# EAGLE design JFETPreamp (EAGLE 6.5.0)
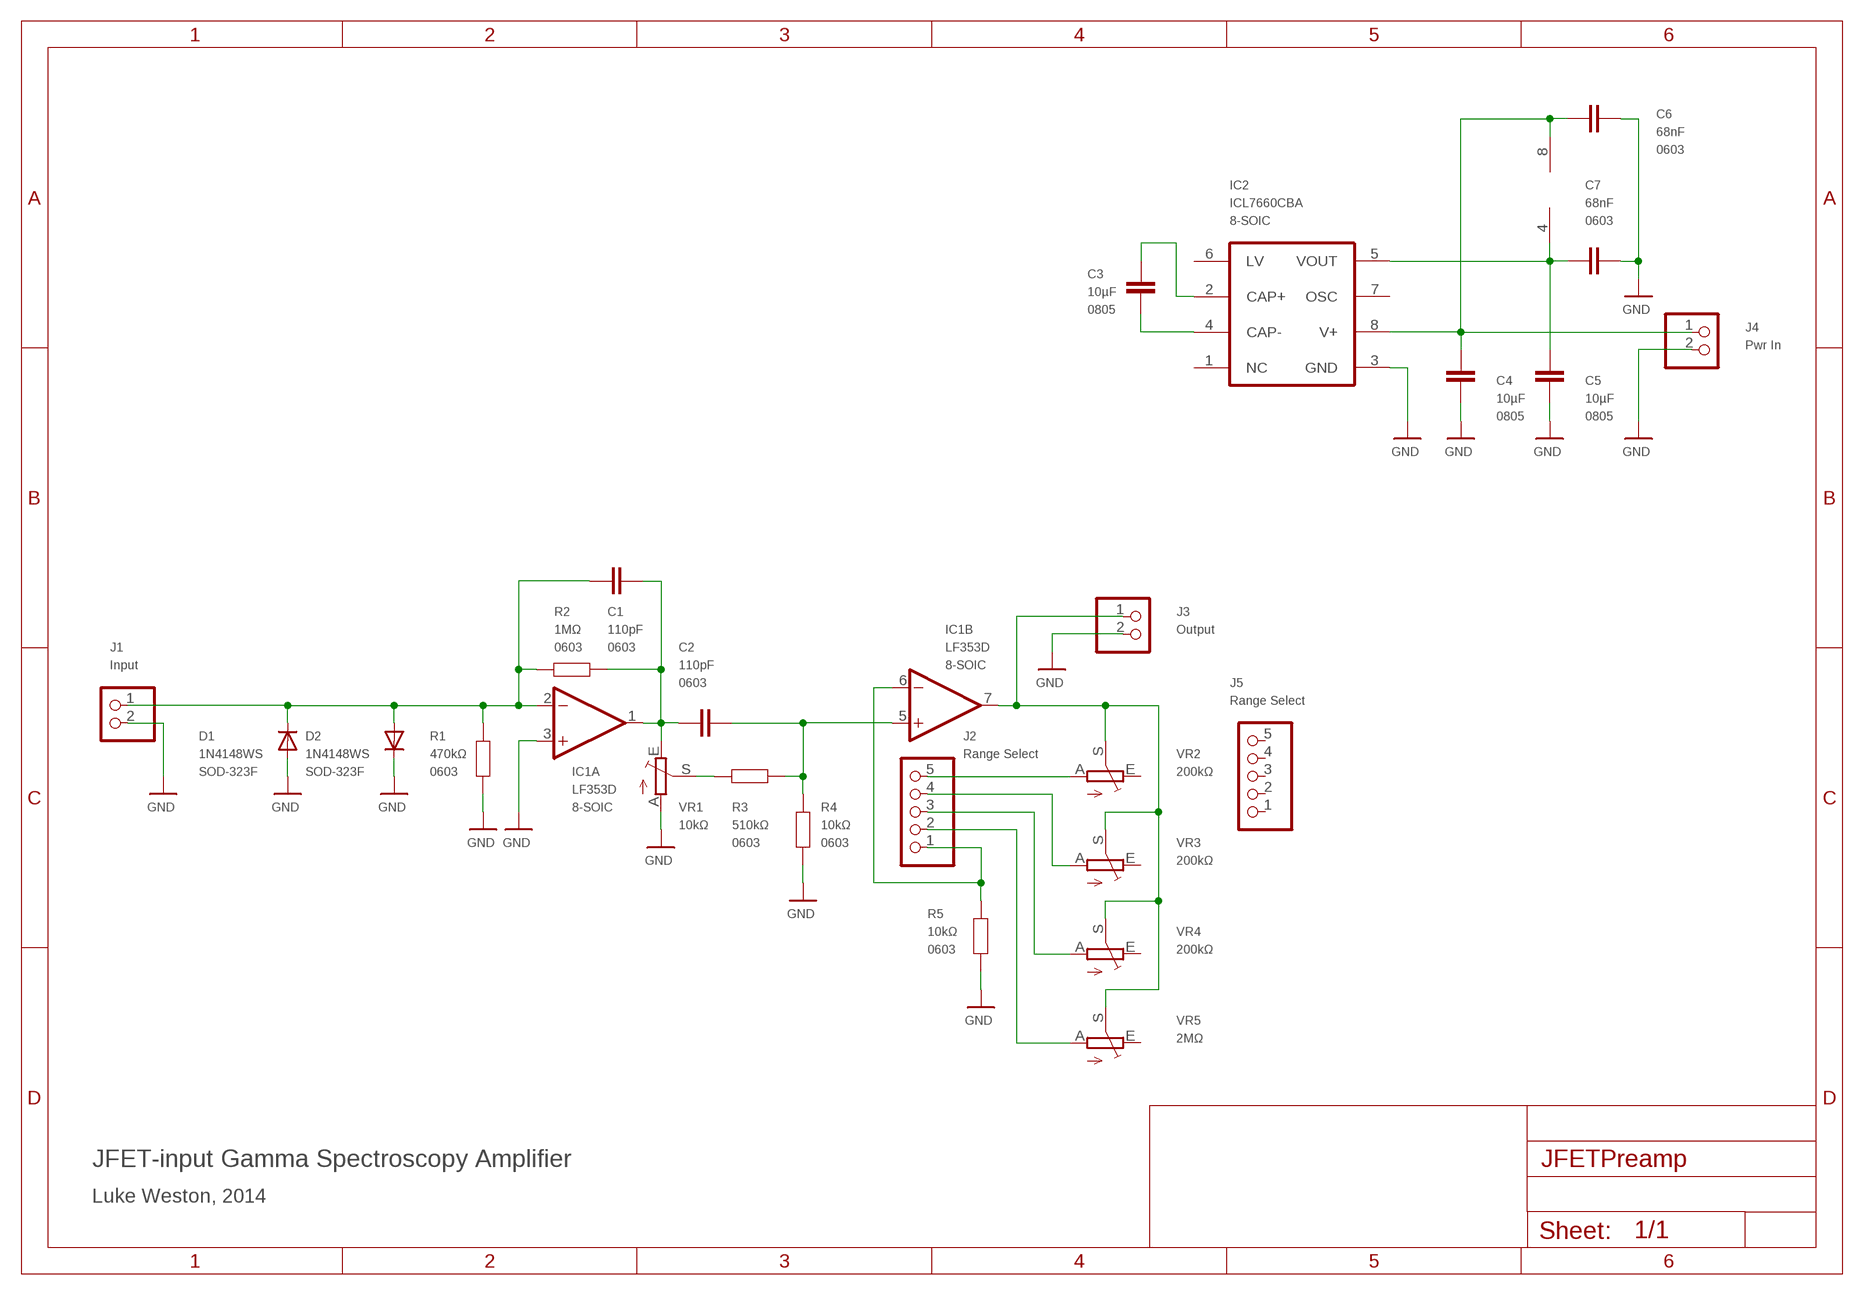
[diagram p0: schematic, sheet 1]

## Parts
C1  110pF  CAPACITOR0603  [0603]
C2  110pF  CAPACITOR0603  [0603]
C3  10µF  C-EUC0805K  [C0805K]
C4  10µF  C-EUC0805K  [C0805K]
C5  10µF  C-EUC0805K  [C0805K]
C6  68nF  CAPACITOR0603  [0603]
C7  68nF  CAPACITOR0603  [0603]
D1  1N4148WS  DIODESOD  [SOD-323]
D2  1N4148WS  DIODESOD  [SOD-323]
IC1  LF353D  [SO08]
IC2  ICL7660CBA  ICL7660CSA  [SO08]
J1  Input  PINHD-1X2  [1X02]
J2  Range Select  PINHD-1X5  [1X05]
J3  Output  PINHD-1X2  [1X02]
J4  Pwr In  PINHD-1X2  [1X02]
J5  Range Select  PINHD-1X5  [1X05]
R1  470kΩ  RESISTOR-EU0603  [0603]
R2  1MΩ  RESISTOR-EU0603  [0603]
R3  510kΩ  RESISTOR-EU0603  [0603]
R4  10kΩ  RESISTOR-EU0603  [0603]
R5  10kΩ  RESISTOR-EU0603  [0603]
VR1  10kΩ  TRIM_EU-B25P  [B25P]
VR2  200kΩ  TRIM_EU-B25P  [B25P]
VR3  200kΩ  TRIM_EU-B25P  [B25P]
VR4  200kΩ  TRIM_EU-B25P  [B25P]
VR5  2MΩ  TRIM_EU-B25P  [B25P]

## Nets
GND: C4.2 C5.2 C6.1 C7.1 D1.2(A) D2.1(C) IC1.3(A:+IN) IC2.3(GND) J1.2 J3.2 J4.2 R1.1 R4.2 R5.2 VR1.A
N$1: C1.1 D1.1(C) D2.2(A) IC1.2(A:-IN) J1.1 R1.2 R2.2
N$2: C2.2 IC1.5(B:+IN) R3.1 R4.1
N$3: C1.2 C2.1 IC1.1(A:OUT) R2.1 VR1.E
N$4: IC1.6(B:-IN) J2.1 R5.1
N$5: R3.2 VR1.S
N$6: J2.5 VR2.A
N$7: IC1.7(B:OUT) J3.1 VR2.S VR3.S VR4.S VR5.S
N$8: J2.4 VR3.A
N$9: J2.3 VR4.A
N$10: J2.2 VR5.A
N$11: C5.1 C7.2 IC1.4(P:V-) IC2.5(VOUT)
N$13: C4.1 C6.2 IC1.8(P:V+) IC2.8(V+) J4.1
N$15: C3.1 IC2.2(CAP+)
N$16: C3.2 IC2.4(CAP-)
Unconnected: IC2.1(NC) IC2.6(LV) IC2.7(OSC) J5.1 J5.2 J5.3 J5.4 J5.5 VR2.E VR3.E VR4.E VR5.E

## Notes on the sheet
- JFET-input Gamma Spectroscopy Amplifier
- Luke Weston, 2014

## Library data of the parts
C1 C2 C6 C7 = freetronics-luke:CAPACITOR; PACKAGE: 0603
C3-C5 = rcl:C-EU: CAPACITOR, European symbol; PACKAGE: 0805
D1 D2 = SparkFun:DIODE: Diode These are standard reverse protection diodes and small signal diodes. SMA package can handle up to about 1A. SOD-323 can handle about 200mA. What the SOD-323 package when ordering, there are some mfgs out there that are 5-pin packages.; PACKAGE: SOD-323F
IC1 = linear:LF353: OP AMP; PACKAGE: 8-SOIC
IC2 = maxim:ICL7660CSA: VOLTAGE CONVERTER; MF: MAXIM; MPN: ICL7660CSA; OC_FARNELL: 9724710; OC_NEWARK: 34C3732; PACKAGE: 8-SOIC
J1 J3 J4 = pinhead:PINHD-1X2: PIN HEADER
J2 J5 = pinhead:PINHD-1X5: PIN HEADER
R1-R5 = freetronics-luke:RESISTOR-EU: Chip resistor, EU symbol; PACKAGE: 0603
VR1-VR5 = pot:TRIM_EU-: POTENTIOMETER

## Board
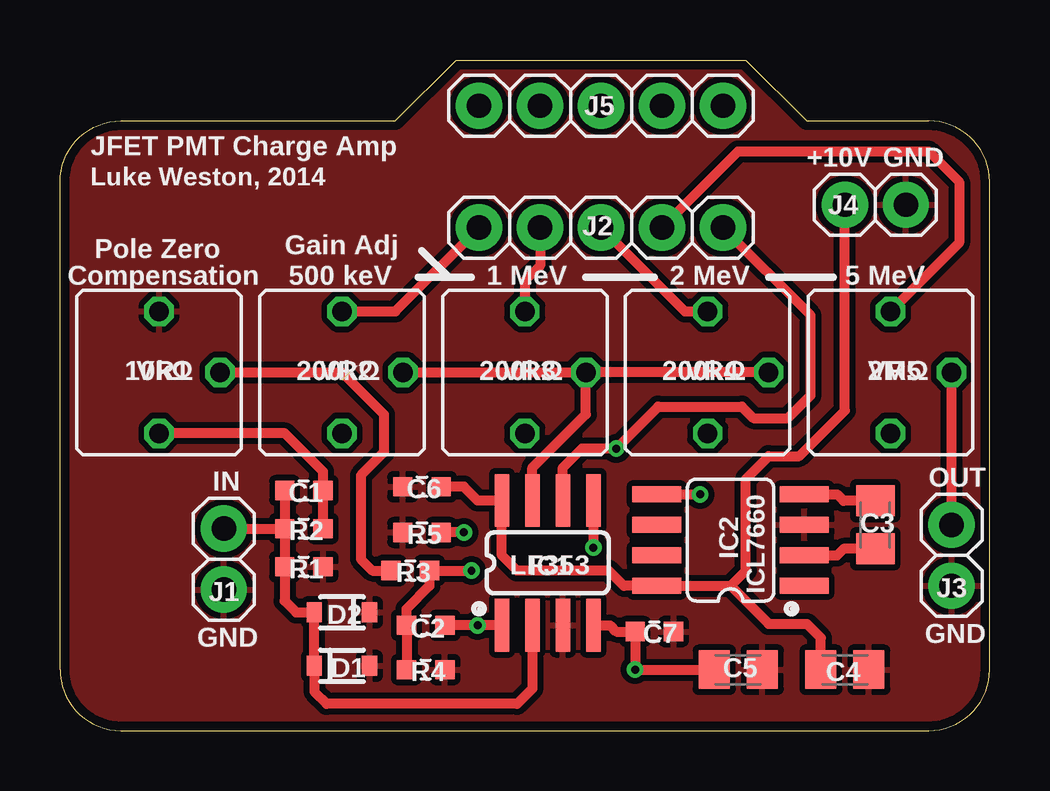
[diagram p1: board, top side]
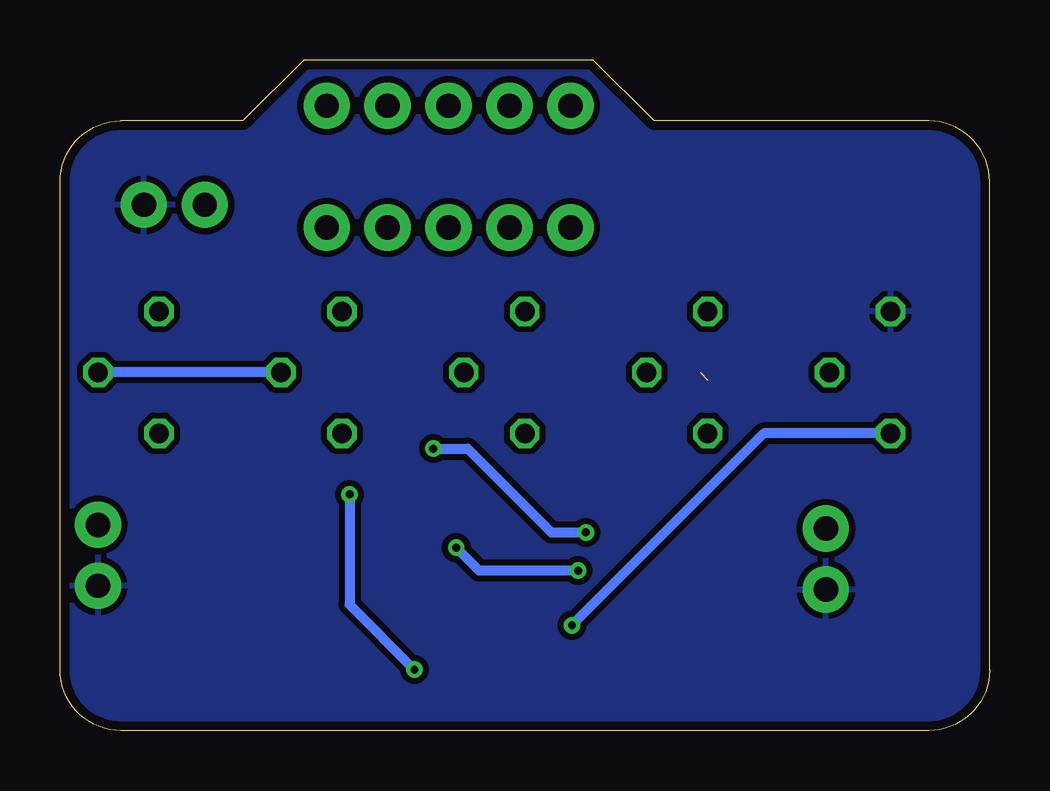
[diagram p2: board, bottom side, seen from below]

Size 38.73 x 27.94 mm. Coordinates in mm from the lower left corner, seen from the top.
Outline: 0,2.54 0,22.86 arc-90 2.54,25.4 13.97,25.4 16.51,27.94 28.57,27.94 31.11,25.4 36.2,25.4 arc-90 38.73,22.86 38.73,2.54 arc-90 36.2,0 2.54,0 arc-90 0,2.54
Copper layers (1*16): Top 0.0356mm / dielectric 1.5011mm / Bottom 0.0356mm
Design rules "LaenPCBOrder *": minimum track width 6mil, minimum drill 13mil, track to track 6mil, track to pad 6mil, pad to pad 6mil, via to via 6mil, smd to smd 6mil, copper to edge 15mil, drill to drill 6mil, minimum pad ring 7mil, minimum via ring 7mil, stop-mask expansion 3mil, vias tented up to drill 14mil, thermal gap 10mil
Milling: 1 lines

### Footprints (pad centres in the part's own frame; a part is rotated, then mirrored left to right if it is on the bottom)
0603 = smd 0.8 x 0.8: 1 -0.8,0; 2 0.8,0
C0805K = smd 1.3 x 1.6: 1 -1,0; 2 1,0
SOD-323 = smd 0.63 x 0.83: 1 -1.15,0; 2 1.15,0
SO08 = smd 0.6 x 2.2: 1 -1.905,-2.6; 2 -0.635,-2.6; 3 0.635,-2.6; 4 1.905,-2.6; 5 1.905,2.6; 6 0.635,2.6; 7 -0.635,2.6; 8 -1.905,2.6
SO08' = smd 0.66 x 2.032: 1 -1.905,-3.073; 2 -0.635,-3.073; 3 0.635,-3.073; 4 1.905,-3.073; 5 1.905,3.073; 6 0.635,3.073; 7 -0.635,3.073; 8 -1.905,3.073
1X02 = drill 1.016 pad 1.93: 1 -1.27,0; 2 1.27,0
1X05 = drill 1.016 pad 1.93: 1 -5.08,0; 2 -2.54,0; 3 0,0; 4 2.54,0; 5 5.08,0
B25P = drill 0.813 octagon: A -2.54,0; E 2.54,0; S 0,2.54

### Placement (x,y rotation side)
C1  10.16,10 0 top
C2  15.24,4.38 180 top
C3  33.97,8.57 90 top
C4  32.7,2.54 0 top
C5  28.26,2.54 0 top
C6  15.08,10.16 0 top
C7  24.77,4.13 180 top
D1  11.75,2.7 0 top
D2  11.75,4.92 180 top
IC1  20.32,6.99 0 top
IC2  ICL7660CBA  [SO08']  27.94,7.94 90 top
J1  6.83,7.14 270 top
J2  22.54,20.95 180 top
J3  37.15,7.3 270 top
J4  33.97,21.91 0 top
J5  22.54,26.04 0 top
R1  10.16,6.83 180 top
R2  10.16,8.41 180 top
R3  14.59,6.67 180 top
R4  15.24,2.54 0 top
R5  15.08,8.26 180 top
VR1  4.13,14.92 270 top
VR2  11.75,14.92 270 top
VR3  19.37,14.92 270 top
VR4  26.99,14.92 270 top
VR5  34.61,14.92 270 top

### Tracks (layer width: path | path; a pad name or v marks a point on that pad's centre or on a via)
GND
  pour Top (isolate 0.254): 0,0 38.73,0 38.73,27.94 0,27.94
  pour Bottom (isolate 0.254): 0,0 38.73,0 38.73,27.94 0,27.94
N$1
  Top 0.406: R2.2 R1.2 9.36,5.4 9.84,4.92 D2.2 D1.1 10.6,1.63 11.11,1.11 19.05,1.11 19.68,1.75 IC1.2 | C1.1 R2.2 | J1.1 R2.2
N$2  (via drill 0.33)
  Top 0.406: IC1.5 v22.23,7.62 | C2.2 | C2.2 R4.1 | R4.1 | C2.2 14.44,5.07 15.39,6.03 R3.1 v17.14,6.67
  Bottom 0.406: v17.14,6.67 21.27,6.67 v22.23,7.62
N$3  (via drill 0.33)
  Top 0.406: IC1.1 v17.4,4.38 C2.1 | R2.1 C1.2 10.96,10.79 9.37,12.38 VR1.E
  Bottom 0.406: VR1.E 9.4,12.38 v17.4,4.38
N$4  (via drill 0.33)
  Top 0.406: v16.83,8.26 R5.1 | IC1.6 20.95,10.95 21.75,11.75 v23.18,11.75 24.92,13.49 28.42,13.49 28.89,13.02 30.32,13.02 31.27,13.97 31.27,17.3 J2.1
  Bottom 0.406: v16.83,8.26 18.26,8.26 21.75,11.75 v23.18,11.75
N$5
  Top 0.406: R3.2 13.02,6.67 12.54,7.14 12.54,10.64 13.49,11.59 13.49,13.18 11.75,14.92 VR1.S
N$6
  Top 0.406: VR2.A 13.97,17.46 J2.5
N$7
  Top 0.406: VR2.S VR3.S | J3.1 VR5.S | IC1.7 19.68,10.95 21.91,13.18 VR3.S | VR4.S VR3.S
  Bottom 0.406: VR4.S VR5.S
N$8
  Top 0.406: J2.4 20,19.37 19.37,18.73 VR3.A
N$9
  Top 0.406: J2.3 26.04,17.46 VR4.A
N$10
  Top 0.406: J2.2 28.26,24.13 36.2,24.13 37.47,22.86 37.47,20.32 VR5.A
N$11  (via drill 0.33)
  Top 0.406: IC2.5 v26.67,9.84 | IC1.4 22.92,4.38 23.18,4.13 C7.2 v23.96,2.54 C5.1
  Bottom 0.406: v26.67,9.84 26.67,5.25 v23.96,2.54
N$13
  Top 0.406: 27.94,6.03 IC2.8 23.5,6.03 22.86,6.67 19.05,6.67 18.41,7.3 IC1.8 17.4,9.59 16.83,10.16 C6.2 | 27.94,6.03 28.57,6.67 28.57,10.48 29.53,11.43 30.8,11.43 32.7,13.34 J4.1 | C4.1 31.7,3.86 31.11,4.45 29.53,4.45 27.94,6.03
N$15
  Top 0.406: IC2.2 32.38,7.3 32.66,7.57 C3.1
N$16
  Top 0.406: IC2.4 32.38,9.84 32.66,9.57 C3.2

### Text on the board
tPlace: JFET PMT Charge Amp | Luke Weston, 2014 | +10V | GND | Pole Zero | Gain Adj | Compensation | 500 keV | 1 MeV | 2 MeV | 5 MeV | 10kΩ | 200kΩ | 200kΩ | 200kΩ | 2MΩ | IN | OUT | LF353 | ICL7660 | GND | GND